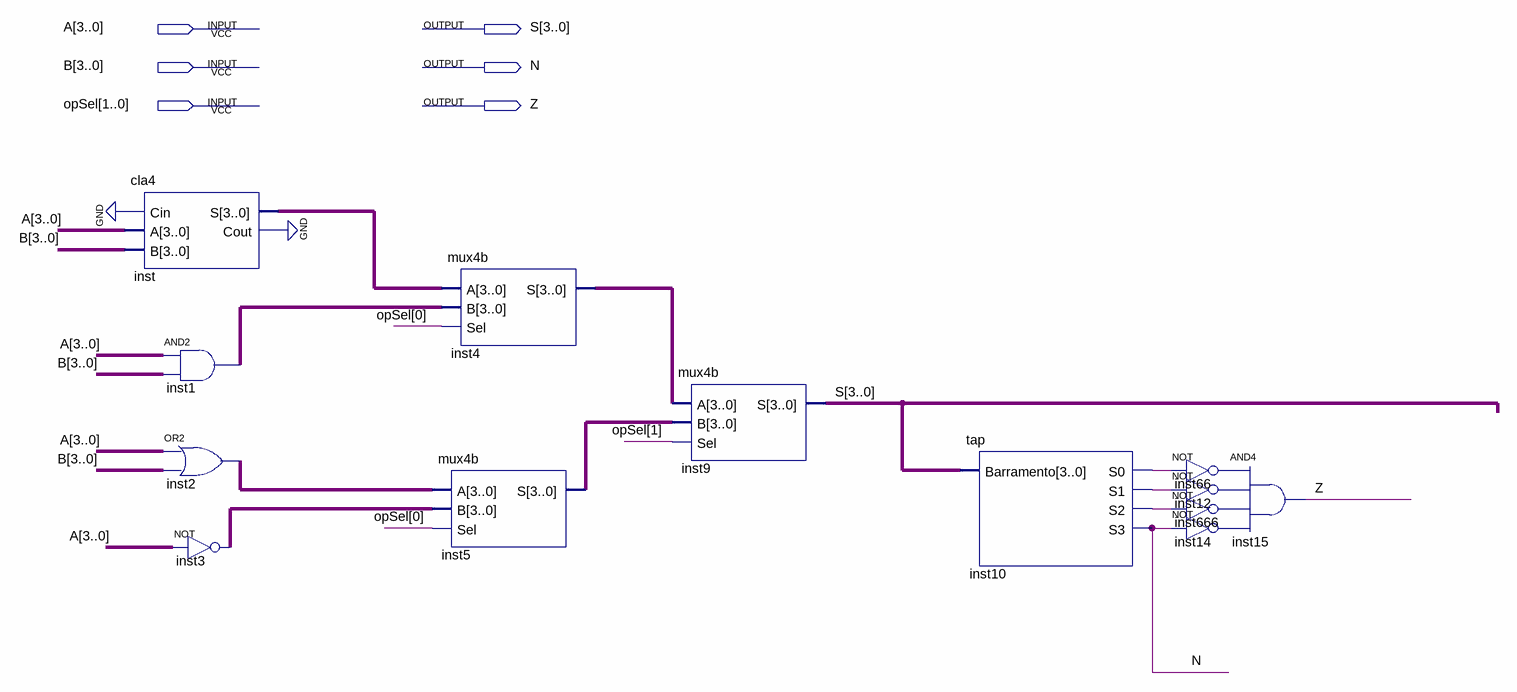
[diagram p0: schematic sheet]
// Quartus schematic ula4b.bdf as structural Verilog: 13 symbols, 6 pins
module ula4b (
  input  [3:0] A,
  input  [3:0] B,
  input  [1:0] opSel,
  output [3:0] S,
  output N,
  output Z
);

  wire inst10_s0, inst10_s1, inst10_s2, inst12_out, inst14_out, inst66_out, inst666_out, inst_cout;
  wire [3:0] inst1_out, inst2_out, inst3_out, inst4_s, inst5_s, inst_s;

  cla4 inst (.Cin(1'b0), .A(A), .B(B), .S(inst_s), .Cout(inst_cout));
  assign inst1_out = A & B;  // AND2 inst1, 4 bits wide
  assign inst2_out = A | B;  // OR2 inst2, 4 bits wide
  assign inst3_out = ~A;  // NOT inst3, 4 bits wide
  mux4b inst4 (.A(inst_s), .B(inst1_out), .Sel(opSel[0]), .S(inst4_s));
  mux4b inst5 (.A(inst2_out), .B(inst3_out), .Sel(opSel[0]), .S(inst5_s));
  mux4b inst9 (.A(inst4_s), .B(inst5_s), .Sel(opSel[1]), .S(S));
  tap inst10 (.Barramento(S), .S0(inst10_s0), .S1(inst10_s1), .S2(inst10_s2), .S3(N));
  not inst66 (inst66_out, inst10_s0);
  not inst12 (inst12_out, inst10_s1);
  not inst666 (inst666_out, inst10_s2);
  not inst14 (inst14_out, N);
  and inst15 (Z, inst66_out, inst12_out, inst666_out, inst14_out);
  // also tied to GND on the sheet: inst_cout
endmodule
